# Altium schematic sheet PMICs.SchDoc
size A; SheetNumber: 5; SheetTotal: 7
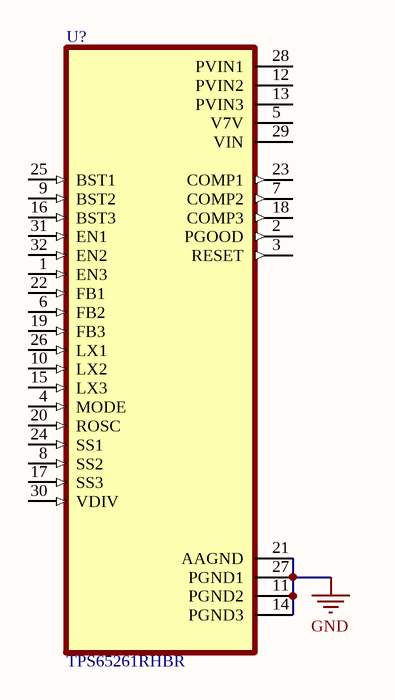
[diagram p0: PMICs.SchDoc]

## Parts
U?  TPS65261RHBR  [IC_ADS125H01IRHBT]

## Nets
GND: U?.11(PGND2) U?.14(PGND3) U?.21(AAGND) U?.27(PGND1)

Not connected (* = marked no-connect by the designer): U? 1(EN3) 2(PGOOD) 3(RESET) 4(MODE) 5(V7V) 6(FB2) 7(COMP2) 8(SS2) 9(BST2) 10(LX2) 12(PVIN2) 13(PVIN3) 15(LX3) 16(BST3) 17(SS3) 18(COMP3) 19(FB3) 20(ROSC) 22(FB1) 23(COMP1) 24(SS1) 25(BST1) 26(LX1) 28(PVIN1) 29(VIN) 30(VDIV) 31(EN1) 32(EN2)

## Library data of the parts
U? = TPS65261RHBR: 4.5V to 18V Input Voltage, 3A/2A/2A Output Current Triple Synchronous Buck Converter 32-VQFN -40 to 85; MF: Texas Instruments; MP: TPS65261RHBR; Purchase-URL: https://pricing.snapeda.com/search/part/TPS65261RHBR/?ref=eda; Value: *; SnapEDA_Link: https://www.snapeda.com/parts/TPS65261RHBR/Texas%20Instruments/view-part/481678/?ref=snap; Price: None; Package: VQFN-32 Texas Instruments; Check_prices: https://www.snapeda.com/parts/TPS65261RHBR/Texas%20Instruments/view-part/481678/?ref=eda; Availability: Good